# EAGLE design charger (EAGLE 8.0.1)
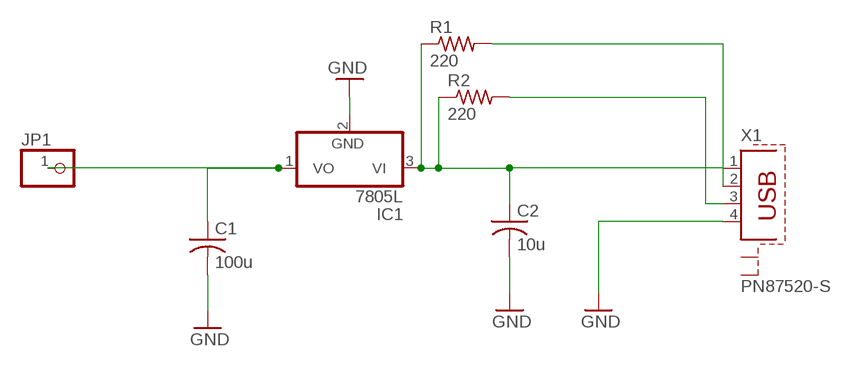
[diagram p0: schematic, sheet 1]

## Parts
C1  100u  C-US025-040X050  [C025-040X050]
C2  10u  C-US025-040X050  [C025-040X050]
IC1  7805L  [TO92]
JP1  PINHD-1X1  [1X01]
R1  220  R-US_0204/7  [0204/7]
R2  220  R-US_0204/7  [0204/7]
X1  PN87520-S  [PN87520-S]

## Nets
GND: C1.2 C2.2 IC1.2(GND) X1.4
N$1: C1.1 IC1.1(VO) JP1.1
N$2: C2.1 IC1.3(VI) R1.1 R2.1 X1.1
N$3: R1.2 X1.2
N$5: R2.2 X1.3
Unconnected: X1.S1 X1.S2

## Library data of the parts
C1 C2 = adafruit:C-US: CAPACITOR, American symbol
IC1 = adafruit:78*: Positive VOLTAGE REGULATOR Added bigger pads to the TO-92 package
JP1 = pinhead:PINHD-1X1: PIN HEADER
R1 R2 = adafruit:R-US_: RESISTOR, American symbol
X1 = con-berg:PN87520-S; OC_FARNELL: unknown; OC_NEWARK: unknown

## Net classes
0 default: width 0.254 mm, drill 0.305 mm, clearance 0.508 mm

## Board
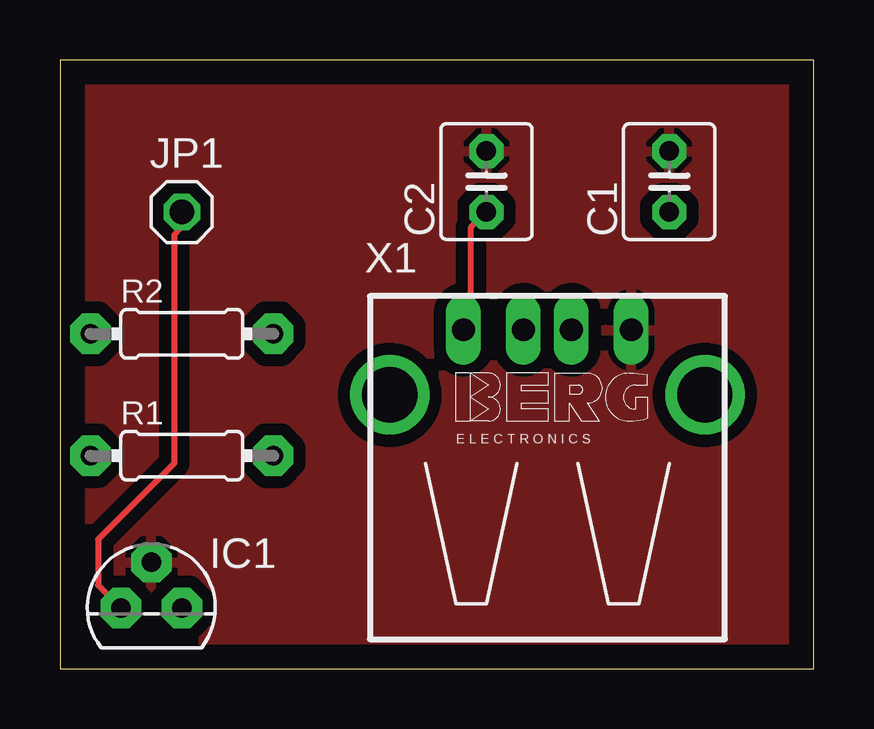
[diagram p1: board, top side]
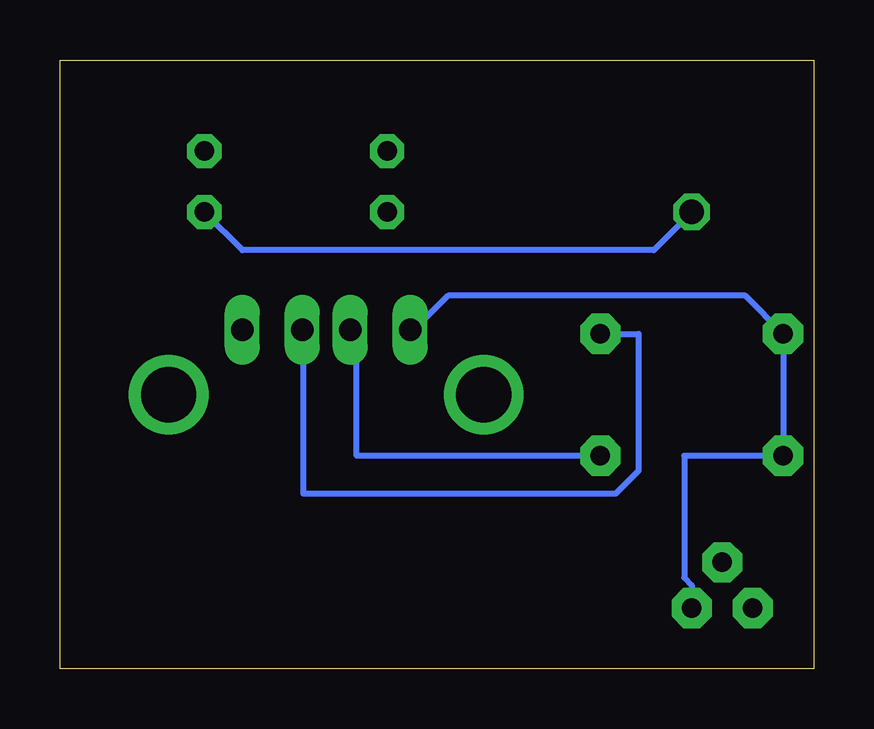
[diagram p2: board, bottom side, seen from below]

Size 31.42 x 25.39 mm. Coordinates in mm from the lower left corner, seen from the top.
Outline: 0,0 31.42,0 31.42,25.39 0,25.39 0,0
Copper layers (1*16): Top 0.035mm / dielectric 1.5mm / Bottom 0.035mm
Design rules "default": minimum track width 10mil, minimum drill 24mil, track to track 8mil, track to pad 8mil, pad to pad 8mil, via to via 8mil, smd to smd 8mil, copper to edge 40mil, drill to drill 8mil, minimum pad ring 10mil, minimum via ring 8mil, stop-mask expansion 4mil, vias tented up to drill 0mil, thermal gap 10mil

### Footprints (pad centres in the part's own frame; a part is rotated, then mirrored left to right if it is on the bottom)
C025-040X050 = drill 0.813 pad 1.422 octagon: 1 -1.27,0; 2 1.27,0
TO92 = drill 0.813 pad 1.676 octagon: 1 -1.27,0; 2 0,1.905; 3 1.27,0
1X01 = drill 1.016 octagon: 1 0,0
0204/7 = drill 0.813 pad 1.676 octagon: 1 -3.81,0; 2 3.81,0
PN87520-S = drill 0.95 long: 1 -3.5,2.71; 2 -1,2.71; 3 1,2.71; 4 3.5,2.71 | drill 2.3 pad 2.9: S1 -6.57,0; S2 6.57,0

### Placement (x,y rotation side)
C1  25.4,20.32 90 top
C2  17.78,20.32 90 top
IC1  3.81,2.54 0 top
JP1  5.08,19.05 0 top
R1  5.08,8.89 0 top
R2  5.08,13.97 0 top
X1  20.32,11.43 0 top

### Tracks (layer width: path | path; a pad name or v marks a point on that pad's centre or on a via)
GND
  pour Top: -1.27,25.4 -1.27,-1.27 33.02,-1.27 33.02,27.94 -1.27,27.94
N$1
  Top 0.254: IC1.1 1.59,3.49 1.59,5.4 4.76,8.57 4.76,18.1 5.08,18.41 JP1.1
  Bottom 0.254: C1.1 23.81,17.46 6.67,17.46 JP1.1
N$2
  Top 0.254: C2.1 17.14,18.41 17.14,14.61 16.83,14.29 X1.1
  Bottom 0.254: IC1.3 5.08,3.49 5.4,3.81 5.4,8.89 R1.1 R2.1 2.86,15.56 15.24,15.56 16.51,14.29 X1.1
N$3
  Bottom 0.254: R1.2 19.05,8.89 19.05,13.97 X1.2
N$5
  Bottom 0.254: R2.2 7.3,13.97 7.3,8.26 8.26,7.3 21.27,7.3 21.27,13.97 X1.3